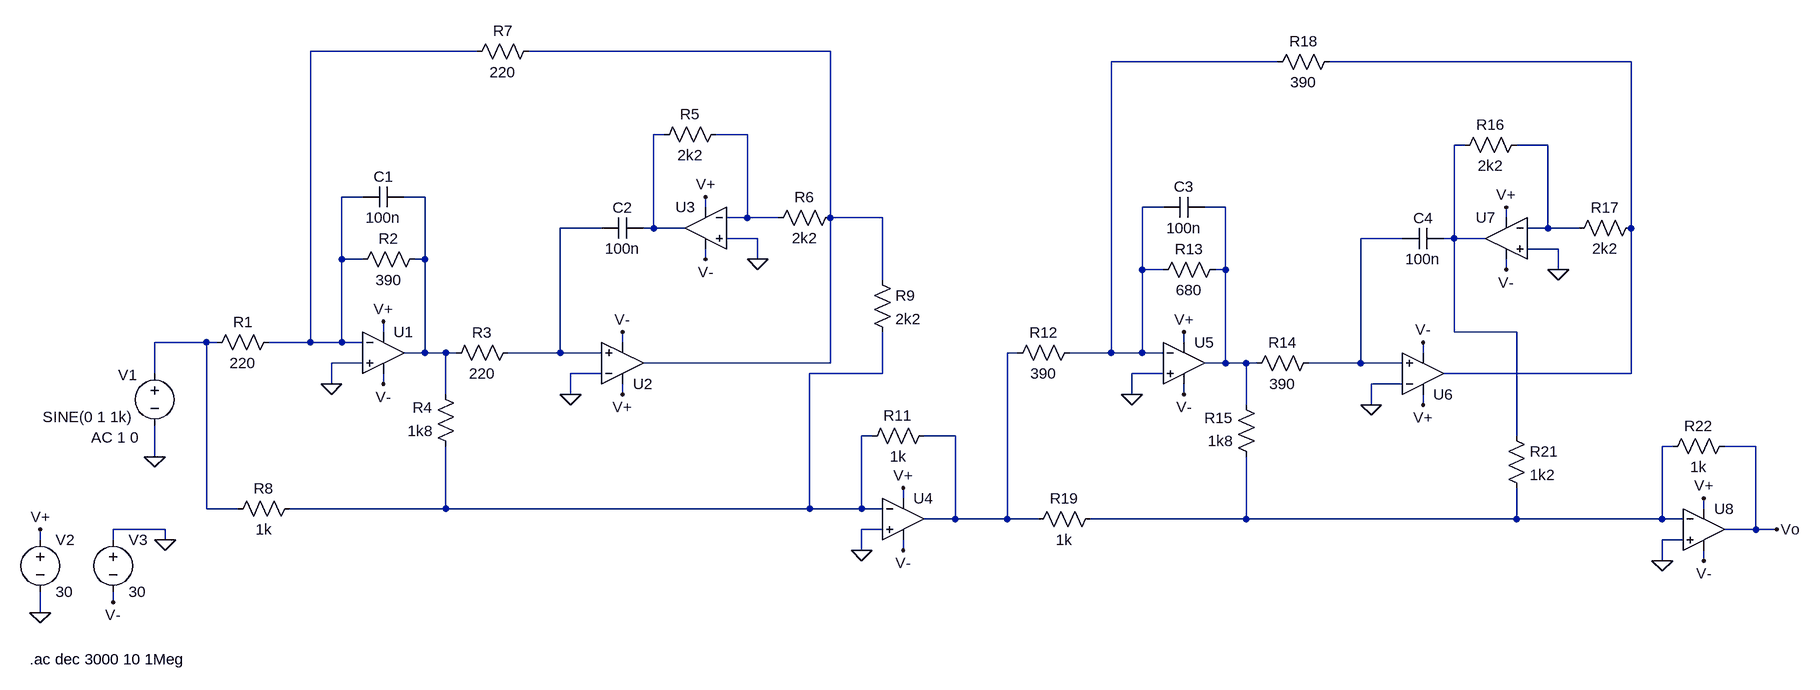
[diagram p0: schematic Ackerberg_Mossberg_Complete.asc]
Ackerberg_Mossberg_Complete.asc, the LTspice schematic file:
Version 4
SHEET 1 2368 680
WIRE 256 -368 0 -368
WIRE 800 -368 336 -368
WIRE 1488 -352 1232 -352
WIRE 2032 -352 1568 -352
WIRE 544 -240 528 -240
WIRE 672 -240 624 -240
WIRE 1776 -224 1760 -224
WIRE 1904 -224 1856 -224
WIRE 80 -144 48 -144
WIRE 176 -144 144 -144
WIRE 608 -128 608 -144
WIRE 1312 -128 1280 -128
WIRE 1408 -128 1376 -128
WIRE 672 -112 672 -240
WIRE 672 -112 640 -112
WIRE 720 -112 672 -112
WIRE 800 -112 800 -368
WIRE 880 -112 800 -112
WIRE 1840 -112 1840 -128
WIRE 448 -96 384 -96
WIRE 528 -96 528 -240
WIRE 528 -96 512 -96
WIRE 576 -96 528 -96
WIRE 1904 -96 1904 -224
WIRE 1904 -96 1872 -96
WIRE 1952 -96 1904 -96
WIRE 2032 -96 2032 -352
WIRE 688 -80 640 -80
WIRE 1680 -80 1616 -80
WIRE 1760 -80 1760 -224
WIRE 1760 -80 1744 -80
WIRE 1808 -80 1760 -80
WIRE 1920 -64 1872 -64
WIRE 48 -48 48 -144
WIRE 80 -48 48 -48
WIRE 176 -48 176 -144
WIRE 176 -48 160 -48
WIRE 608 -48 608 -64
WIRE 688 -48 688 -80
WIRE 1280 -32 1280 -128
WIRE 1312 -32 1280 -32
WIRE 1408 -32 1408 -128
WIRE 1408 -32 1392 -32
WIRE 1840 -32 1840 -48
WIRE 1920 -32 1920 -64
WIRE 880 -16 880 -112
WIRE 112 64 112 48
WIRE 1760 64 1760 -80
WIRE 1856 64 1760 64
WIRE -160 80 -240 80
WIRE -144 80 -160 80
WIRE 0 80 0 -368
WIRE 0 80 -64 80
WIRE 48 80 48 -48
WIRE 48 80 0 80
WIRE 80 80 48 80
WIRE 480 80 480 64
WIRE 1344 80 1344 64
WIRE 176 96 176 -48
WIRE 176 96 144 96
WIRE 208 96 176 96
WIRE 224 96 208 96
WIRE 384 96 384 -96
WIRE 384 96 304 96
WIRE 448 96 384 96
WIRE 1088 96 1072 96
WIRE 1232 96 1232 -352
WIRE 1232 96 1168 96
WIRE 1280 96 1280 -32
WIRE 1280 96 1232 96
WIRE 1312 96 1280 96
WIRE 1712 96 1712 80
WIRE 80 112 32 112
WIRE 800 112 800 -112
WIRE 800 112 512 112
WIRE 1408 112 1408 -32
WIRE 1408 112 1376 112
WIRE 1440 112 1408 112
WIRE 1456 112 1440 112
WIRE 1616 112 1616 -80
WIRE 1616 112 1536 112
WIRE 1680 112 1616 112
WIRE -240 128 -240 80
WIRE 448 128 400 128
WIRE 880 128 880 64
WIRE 880 128 768 128
WIRE 1312 128 1264 128
WIRE 2032 128 2032 -96
WIRE 2032 128 1744 128
WIRE 32 144 32 112
WIRE 112 144 112 128
WIRE 1680 144 1632 144
WIRE 208 160 208 96
WIRE 400 160 400 128
WIRE 480 160 480 144
WIRE 1264 160 1264 128
WIRE 1344 160 1344 144
WIRE 1440 176 1440 112
WIRE 1632 176 1632 144
WIRE 1712 176 1712 160
WIRE 864 224 848 224
WIRE 992 224 944 224
WIRE 1856 224 1856 64
WIRE 2096 240 2080 240
WIRE 2224 240 2176 240
WIRE -240 256 -240 208
WIRE 912 320 912 304
WIRE -160 336 -160 80
WIRE -112 336 -160 336
WIRE 208 336 208 240
WIRE 208 336 -32 336
WIRE 768 336 768 128
WIRE 768 336 208 336
WIRE 848 336 848 224
WIRE 848 336 768 336
WIRE 880 336 848 336
WIRE 2144 336 2144 320
WIRE 992 352 992 224
WIRE 992 352 944 352
WIRE 1072 352 1072 96
WIRE 1072 352 992 352
WIRE 1120 352 1072 352
WIRE 1440 352 1440 256
WIRE 1440 352 1200 352
WIRE 1856 352 1856 304
WIRE 1856 352 1440 352
WIRE 2080 352 2080 240
WIRE 2080 352 1856 352
WIRE 2112 352 2080 352
WIRE -224 368 -304 368
WIRE 880 368 848 368
WIRE 2224 368 2224 240
WIRE 2224 368 2176 368
WIRE 2256 368 2224 368
WIRE -416 384 -416 368
WIRE -304 384 -304 368
WIRE -224 384 -224 368
WIRE 2112 384 2080 384
WIRE 848 400 848 368
WIRE 912 400 912 384
WIRE 2080 416 2080 384
WIRE 2144 416 2144 400
WIRE -304 480 -304 464
WIRE -416 496 -416 464
FLAG 112 48 V+
FLAG 112 144 V-
FLAG 32 144 0
FLAG 480 160 V+
FLAG 480 64 V-
FLAG 608 -144 V+
FLAG 608 -48 V-
FLAG 400 160 0
FLAG 688 -48 0
FLAG -240 256 0
FLAG -416 496 0
FLAG -224 384 0
FLAG -416 368 V+
FLAG -304 480 V-
FLAG 912 304 V+
FLAG 912 400 V-
FLAG 848 400 0
FLAG 1344 64 V+
FLAG 1344 160 V-
FLAG 1264 160 0
FLAG 1712 176 V+
FLAG 1712 80 V-
FLAG 1840 -128 V+
FLAG 1840 -32 V-
FLAG 1632 176 0
FLAG 1920 -32 0
FLAG 2144 320 V+
FLAG 2144 416 V-
FLAG 2080 416 0
FLAG 2256 368 Vo
SYMBOL voltage -240 112 R0
WINDOW 0 -56 18 Left 2
WINDOW 3 -172 83 Left 2
WINDOW 123 -98 114 Left 2
WINDOW 39 0 0 Left 0
SYMATTR InstName V1
SYMATTR Value SINE(0 1 1k)
SYMATTR Value2 AC 1 0
SYMBOL res -48 64 R90
WINDOW 0 0 56 VBottom 2
WINDOW 3 32 56 VTop 2
SYMATTR InstName R1
SYMATTR Value 220
SYMBOL OpAmps\\UniversalOpAmp 112 96 R0
SYMATTR InstName U1
SYMATTR Value2 Avol=1000000Meg GBW=10000000Meg Vos=0
SYMATTR SpiceLine En=0 Enk=0 In=0 Ink=0 Rin=500000000Meg
SYMBOL res 176 -64 R90
WINDOW 0 0 56 VBottom 2
WINDOW 3 32 56 VTop 2
SYMATTR InstName R2
SYMATTR Value 390
SYMBOL cap 144 -160 R90
WINDOW 0 0 32 VBottom 2
WINDOW 3 32 32 VTop 2
SYMATTR InstName C1
SYMATTR Value 100n
SYMBOL res 320 80 R90
WINDOW 0 0 56 VBottom 2
WINDOW 3 32 56 VTop 2
SYMATTR InstName R3
SYMATTR Value 220
SYMBOL res 224 256 R180
WINDOW 0 36 76 Left 2
WINDOW 3 36 40 Left 2
SYMATTR InstName R4
SYMATTR Value 1k8
SYMBOL OpAmps\\UniversalOpAmp 480 112 M180
SYMATTR InstName U2
SYMATTR Value2 Avol=1000000Meg GBW=10000000Meg Vos=0
SYMATTR SpiceLine En=0 Enk=0 In=0 Ink=0 Rin=500000000Meg
SYMBOL cap 512 -112 R90
WINDOW 0 0 32 VBottom 2
WINDOW 3 32 32 VTop 2
SYMATTR InstName C2
SYMATTR Value 100n
SYMBOL OpAmps\\UniversalOpAmp 608 -96 M0
SYMATTR InstName U3
SYMATTR Value2 Avol=1000000Meg GBW=10000000Meg Vos=0
SYMATTR SpiceLine En=0 Enk=0 In=0 Ink=0 Rin=500000000Meg
SYMBOL res 640 -256 R90
WINDOW 0 0 56 VBottom 2
WINDOW 3 32 56 VTop 2
SYMATTR InstName R5
SYMATTR Value 2k2
SYMBOL res 816 -128 R90
WINDOW 0 0 56 VBottom 2
WINDOW 3 32 56 VTop 2
SYMATTR InstName R6
SYMATTR Value 2k2
SYMBOL res 352 -384 R90
WINDOW 0 0 56 VBottom 2
WINDOW 3 32 56 VTop 2
SYMATTR InstName R7
SYMATTR Value 220
SYMBOL res -16 320 R90
WINDOW 0 0 56 VBottom 2
WINDOW 3 32 56 VTop 2
SYMATTR InstName R8
SYMATTR Value 1k
SYMBOL res 864 -32 R0
SYMATTR InstName R9
SYMATTR Value 2k2
SYMBOL voltage -416 368 R0
WINDOW 123 0 0 Left 0
WINDOW 39 0 0 Left 0
SYMATTR InstName V2
SYMATTR Value 30
SYMBOL voltage -304 368 R0
WINDOW 123 0 0 Left 0
WINDOW 39 0 0 Left 0
SYMATTR InstName V3
SYMATTR Value 30
SYMBOL OpAmps\\UniversalOpAmp 912 352 R0
SYMATTR InstName U4
SYMATTR Value2 Avol=1000000Meg GBW=10000000Meg Vos=0
SYMATTR SpiceLine En=0 Enk=0 In=0 Ink=0 Rin=500000000Meg
SYMBOL res 960 208 R90
WINDOW 0 0 56 VBottom 2
WINDOW 3 32 56 VTop 2
SYMATTR InstName R11
SYMATTR Value 1k
SYMBOL res 1184 80 R90
WINDOW 0 0 56 VBottom 2
WINDOW 3 32 56 VTop 2
SYMATTR InstName R12
SYMATTR Value 390
SYMBOL OpAmps\\UniversalOpAmp 1344 112 R0
SYMATTR InstName U5
SYMATTR Value2 Avol=1000000Meg GBW=10000000Meg Vos=0
SYMATTR SpiceLine En=0 Enk=0 In=0 Ink=0 Rin=500000000Meg
SYMBOL res 1408 -48 R90
WINDOW 0 0 56 VBottom 2
WINDOW 3 32 56 VTop 2
SYMATTR InstName R13
SYMATTR Value 680
SYMBOL cap 1376 -144 R90
WINDOW 0 0 32 VBottom 2
WINDOW 3 32 32 VTop 2
SYMATTR InstName C3
SYMATTR Value 100n
SYMBOL res 1552 96 R90
WINDOW 0 0 56 VBottom 2
WINDOW 3 32 56 VTop 2
SYMATTR InstName R14
SYMATTR Value 390
SYMBOL res 1456 272 R180
WINDOW 0 36 76 Left 2
WINDOW 3 36 40 Left 2
SYMATTR InstName R15
SYMATTR Value 1k8
SYMBOL OpAmps\\UniversalOpAmp 1712 128 M180
SYMATTR InstName U6
SYMATTR Value2 Avol=1000000Meg GBW=10000000Meg Vos=0
SYMATTR SpiceLine En=0 Enk=0 In=0 Ink=0 Rin=500000000Meg
SYMBOL cap 1744 -96 R90
WINDOW 0 0 32 VBottom 2
WINDOW 3 32 32 VTop 2
SYMATTR InstName C4
SYMATTR Value 100n
SYMBOL OpAmps\\UniversalOpAmp 1840 -80 M0
SYMATTR InstName U7
SYMATTR Value2 Avol=1000000Meg GBW=10000000Meg Vos=0
SYMATTR SpiceLine En=0 Enk=0 In=0 Ink=0 Rin=500000000Meg
SYMBOL res 1872 -240 R90
WINDOW 0 0 56 VBottom 2
WINDOW 3 32 56 VTop 2
SYMATTR InstName R16
SYMATTR Value 2k2
SYMBOL res 2048 -112 R90
WINDOW 0 0 56 VBottom 2
WINDOW 3 32 56 VTop 2
SYMATTR InstName R17
SYMATTR Value 2k2
SYMBOL res 1584 -368 R90
WINDOW 0 0 56 VBottom 2
WINDOW 3 32 56 VTop 2
SYMATTR InstName R18
SYMATTR Value 390
SYMBOL res 1216 336 R90
WINDOW 0 0 56 VBottom 2
WINDOW 3 32 56 VTop 2
SYMATTR InstName R19
SYMATTR Value 1k
SYMBOL res 1840 208 R0
SYMATTR InstName R21
SYMATTR Value 1k2
SYMBOL OpAmps\\UniversalOpAmp 2144 368 R0
SYMATTR InstName U8
SYMATTR Value2 Avol=1000000Meg GBW=10000000Meg Vos=0
SYMATTR SpiceLine En=0 Enk=0 In=0 Ink=0 Rin=500000000Meg
SYMBOL res 2192 224 R90
WINDOW 0 0 56 VBottom 2
WINDOW 3 32 56 VTop 2
SYMATTR InstName R22
SYMATTR Value 1k
TEXT -432 568 Left 2 !.ac dec 3000 10 1Meg

The netlist it stands for:
* Ackerberg_Mossberg_Complete.asc
V1 N013 0 SINE(0 1 1k) AC 1 0
R1 N001 N013 220
XU1 0 N001 V+ V- N009 level1 Avol=1000000Meg GBW=10000000Meg Vos=0 En=0 Enk=0 In=0 Ink=0 Rin=500000000Meg  ; pins In+ In- V+ V- OUT
R2 N009 N001 390
C1 N009 N001 100n
R3 N011 N009 220
R4 N015 N009 1k8
XU2 N011 0 V+ V- N002 level1 Avol=1000000Meg GBW=10000000Meg Vos=0 En=0 Enk=0 In=0 Ink=0 Rin=500000000Meg  ; pins In+ In- V+ V- OUT
C2 N005 N011 100n
XU3 0 N006 V+ V- N005 level1 Avol=1000000Meg GBW=10000000Meg Vos=0 En=0 Enk=0 In=0 Ink=0 Rin=500000000Meg  ; pins In+ In- V+ V- OUT
R5 N006 N005 2k2
R6 N002 N006 2k2
R7 N002 N001 220
R8 N015 N013 1k
R9 N002 N015 2k2
V2 V+ 0 30
V3 0 V- 30
XU4 0 N015 V+ V- N014 level1 Avol=1000000Meg GBW=10000000Meg Vos=0 En=0 Enk=0 In=0 Ink=0 Rin=500000000Meg  ; pins In+ In- V+ V- OUT
R11 N014 N015 1k
R12 N003 N014 390
XU5 0 N003 V+ V- N010 level1 Avol=1000000Meg GBW=10000000Meg Vos=0 En=0 Enk=0 In=0 Ink=0 Rin=500000000Meg  ; pins In+ In- V+ V- OUT
R13 N010 N003 680
C3 N010 N003 100n
R14 N012 N010 390
R15 N016 N010 1k8
XU6 N012 0 V+ V- N004 level1 Avol=1000000Meg GBW=10000000Meg Vos=0 En=0 Enk=0 In=0 Ink=0 Rin=500000000Meg  ; pins In+ In- V+ V- OUT
C4 N007 N012 100n
XU7 0 N008 V+ V- N007 level1 Avol=1000000Meg GBW=10000000Meg Vos=0 En=0 Enk=0 In=0 Ink=0 Rin=500000000Meg  ; pins In+ In- V+ V- OUT
R16 N008 N007 2k2
R17 N004 N008 2k2
R18 N004 N003 390
R19 N016 N014 1k
R21 N007 N016 1k2
XU8 0 N016 V+ V- Vo level1 Avol=1000000Meg GBW=10000000Meg Vos=0 En=0 Enk=0 In=0 Ink=0 Rin=500000000Meg  ; pins In+ In- V+ V- OUT
R22 Vo N016 1k
.ac dec 3000 10 1Meg
.lib UniversalOpAmp1.lib
.backanno
.end